# EAGLE design driver_04_2_2018 (EAGLE 6.6.0)
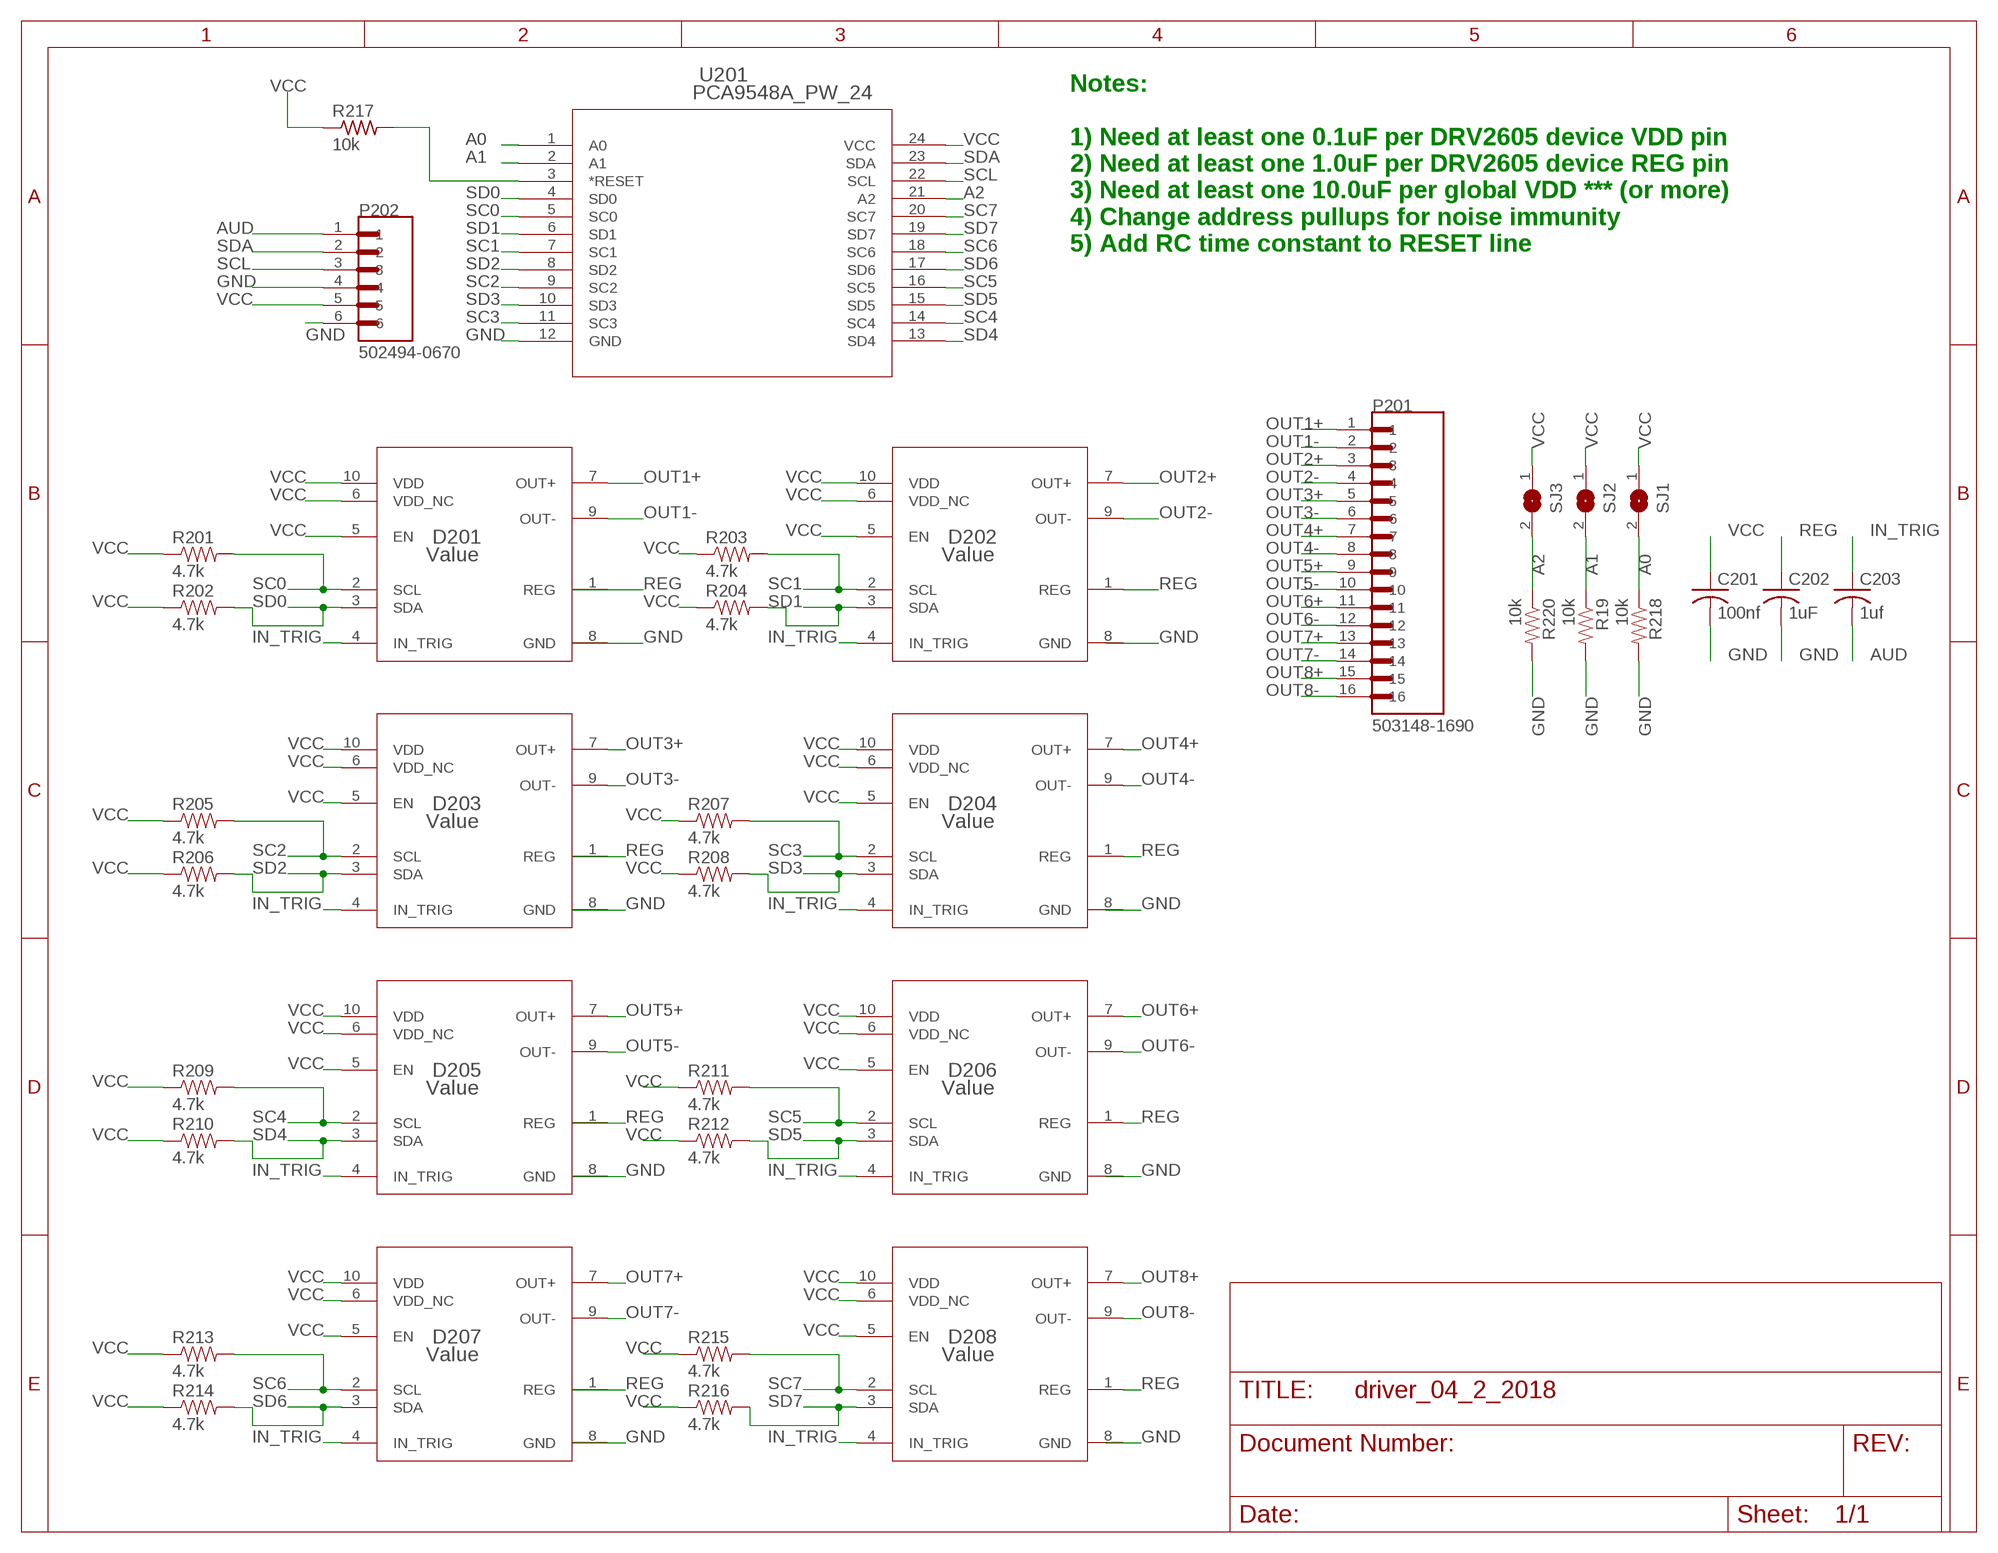
[diagram p0: schematic, sheet 1]

## Parts
C201  100nf  C-USC0603  [C0603]
C202  1uF  C-USC0603  [C0603]
C203  1uf  C-USC0603  [C0603]
D201  Value  DRV2605LDGSR  [DGS0010A]
D202  Value  DRV2605LDGSR  [DGS0010A]
D203  Value  DRV2605LDGSR  [DGS0010A]
D204  Value  DRV2605LDGSR  [DGS0010A]
D205  Value  DRV2605LDGSR  [DGS0010A]
D206  Value  DRV2605LDGSR  [DGS0010A]
D207  Value  DRV2605LDGSR  [DGS0010A]
D208  Value  DRV2605LDGSR  [DGS0010A]
P201  503148-1690  [MOLEX_503148-1690]
P202  502494-0670  [MOLEX_502494-0670]
R19  10k  RESISTOR0402-TYP  [EIA-0402]
R201  4.7k  RESISTOR0402-TYP  [EIA-0402]
R202  4.7k  RESISTOR0402-TYP  [EIA-0402]
R203  4.7k  RESISTOR0402-TYP  [EIA-0402]
R204  4.7k  RESISTOR0402-TYP  [EIA-0402]
R205  4.7k  RESISTOR0402-TYP  [EIA-0402]
R206  4.7k  RESISTOR0402-TYP  [EIA-0402]
R207  4.7k  RESISTOR0402-TYP  [EIA-0402]
R208  4.7k  RESISTOR0402-TYP  [EIA-0402]
R209  4.7k  RESISTOR0402-TYP  [EIA-0402]
R210  4.7k  RESISTOR0402-TYP  [EIA-0402]
R211  4.7k  RESISTOR0402-TYP  [EIA-0402]
R212  4.7k  RESISTOR0402-TYP  [EIA-0402]
R213  4.7k  RESISTOR0402-TYP  [EIA-0402]
R214  4.7k  RESISTOR0402-TYP  [EIA-0402]
R215  4.7k  RESISTOR0402-TYP  [EIA-0402]
R216  4.7k  RESISTOR0402-TYP  [EIA-0402]
R217  10k  R-US_R0402  [R0402]
R218  10k  RESISTOR0402-TYP  [EIA-0402]
R220  10k  RESISTOR0402-TYP  [EIA-0402]
SJ1  SJ  [SJ]
SJ2  SJ  [SJ]
SJ3  SJ  [SJ]
U201  PCA9548A_PW_24  [PW24]

## Nets
A0: R218.1 SJ1.2 U201.1(A0)
A1: R19.1 SJ2.2 U201.2(A1)
A2: R220.1 SJ3.2 U201.21(A2)
AUD: C203.2 P202.1
GND: C201.2 C202.2 D201.8(GND) D202.8(GND) D203.8(GND) D204.8(GND) D205.8(GND) D206.8(GND) D207.8(GND) D208.8(GND) P202.4 P202.6 R19.2 R218.2 R220.2 U201.12(GND)
IN_TRIG: C203.1 D201.4(IN_TRIG) D202.4(IN_TRIG) D203.4(IN_TRIG) D204.4(IN_TRIG) D205.4(IN_TRIG) D206.4(IN_TRIG) D207.4(IN_TRIG) D208.4(IN_TRIG)
OUT1+: D201.7(OUT+) P201.1
OUT1-: D201.9(OUT-) P201.2
OUT2+: D202.7(OUT+) P201.3
OUT2-: D202.9(OUT-) P201.4
OUT3+: D203.7(OUT+) P201.5
OUT3-: D203.9(OUT-) P201.6
OUT4+: D204.7(OUT+) P201.7
OUT4-: D204.9(OUT-) P201.8
OUT5+: D205.7(OUT+) P201.9
OUT5-: D205.9(OUT-) P201.10
OUT6+: D206.7(OUT+) P201.11
OUT6-: D206.9(OUT-) P201.12
OUT7+: D207.7(OUT+) P201.13
OUT7-: D207.9(OUT-) P201.14
OUT8+: D208.7(OUT+) P201.15
OUT8-: D208.9(OUT-) P201.16
REG: C202.1 D201.1(REG) D202.1(REG) D203.1(REG) D204.1(REG) D205.1(REG) D206.1(REG) D207.1(REG) D208.1(REG)
RESET: R217.2 U201.3(*RESET)
SC0: D201.2(SCL) R201.2 U201.5(SC0)
SC1: D202.2(SCL) R203.2 U201.7(SC1)
SC2: D203.2(SCL) R205.2 U201.9(SC2)
SC3: D204.2(SCL) R207.2 U201.11(SC3)
SC4: D205.2(SCL) R209.2 U201.14(SC4)
SC5: D206.2(SCL) R211.2 U201.16(SC5)
SC6: D207.2(SCL) R213.2 U201.18(SC6)
SC7: D208.2(SCL) R215.2 U201.20(SC7)
SCL: P202.3 U201.22(SCL)
SD0: D201.3(SDA) R202.2 U201.4(SD0)
SD1: D202.3(SDA) R204.2 U201.6(SD1)
SD2: D203.3(SDA) R206.2 U201.8(SD2)
SD3: D204.3(SDA) R208.2 U201.10(SD3)
SD4: D205.3(SDA) R210.2 U201.13(SD4)
SD5: D206.3(SDA) R212.2 U201.15(SD5)
SD6: D207.3(SDA) R214.2 U201.17(SD6)
SD7: D208.3(SDA) R216.2 U201.19(SD7)
SDA: P202.2 U201.23(SDA)
VCC: C201.1 D201.5(EN) D201.6(VDD_NC) D201.10(VDD) D202.5(EN) D202.6(VDD_NC) D202.10(VDD) D203.5(EN) D203.6(VDD_NC) D203.10(VDD) D204.5(EN) D204.6(VDD_NC) D204.10(VDD) D205.5(EN) D205.6(VDD_NC) D205.10(VDD) D206.5(EN) D206.6(VDD_NC) D206.10(VDD) D207.5(EN) D207.6(VDD_NC) D207.10(VDD) D208.5(EN) D208.6(VDD_NC) D208.10(VDD) P202.5 R201.1 R202.1 R203.1 R204.1 R205.1 R206.1 R207.1 R208.1 R209.1 R210.1 R211.1 R212.1 R213.1 R214.1 R215.1 R216.1 R217.1 SJ1.1 SJ2.1 SJ3.1 U201.24(VCC)

## Notes on the sheet
- Notes:
  
  1) Need at least one 0.1uF per DRV2605 device VDD pin
  2) Need at least one 1.0uF per DRV2605 device REG pin
  3) Need at least one 10.0uF per global VDD *** (or more)
  4) Change address pullups for noise immunity
  5) Add RC time constant to RESET line

## Library data of the parts
C201-C203 = rcl:C-US: CAPACITOR, American symbol
D201-D208 = DRV2605L_DGSR:DRV2605LDGSR; COMPTYPE: IC; MANUFACTURER: Texas Instruments; MOUNTTYPE: SMT; PACKAGEREFERENCE: DGS0010A; PARTNUMBER: DRV2605LDGS; PIN_COUNT: 10; REFDES: RefDes; ROHS: Y; TYPE: TYPE
P201 = 503148-1690:503148-1690: 1.50mm Pitch CLIK-Mate™ Wire-to-Board PCB Receptacle, Dual Row, Right Angle, 16 Circuits; AVAILABILITY: Good; DESCRIPTION: 1.50mm Pitch CLIK-Mate™ Wire-to-Board PCB Receptacle, Dual Row, Right Angle, 16 Circuits; MF: Molex; MP: 503148-1690; PACKAGE: None; PRICE: 1.51 USD
P202 = 502494-0670:502494-0670: 2.00mm Pitch CLIK-Mate™ Wire-to-Board PCB Receptacle, Single Row, Right Angle, 6 Circuits; AVAILABILITY: Good; DESCRIPTION: 2.00mm Pitch CLIK-Mate™ Wire-to-Board PCB Receptacle, Single Row, Right Angle, 6 Circuits; MF: Molex; MP: 502494-0670; PACKAGE: None; PRICE: 0.53 USD
R19 R201-R216 R218 R220 = PatternAgents-ProtoPads:RESISTOR: Resistor Basic schematic elements and footprints for 0603, 1206, and PTH resistors.
R217 = resistor:R-US_: RESISTOR, American symbol
SJ1-SJ3 = jumper:SJ: SMD solder JUMPER
U201 = PCA9548A_PW_124:PCA9548A_PW_24; DATASHEETURL: http://www.ti.com/lit/gpn/PCA9548A; DESCRIPTION: 8-Channel I2C Switch With Reset; FAMILY_NAME: I2C MULTIPLEXER, SWITCH; GENERIC_PART_NUMBER: PCA9548A; INDUSTRY_STD_PKG_TYPE: TSSOP; MANUFACTURER: Texas Instruments; MANUFACTURER_PART_NUMBER: pca9548a_pw_24; PACKAGE_DESIGNATOR: PW; PIN_COUNT: 24; VENDOR: Texas Instruments

## Net classes
0 default: width 0.1 mm, drill 0.185 mm, clearance 0.1 mm

## Board
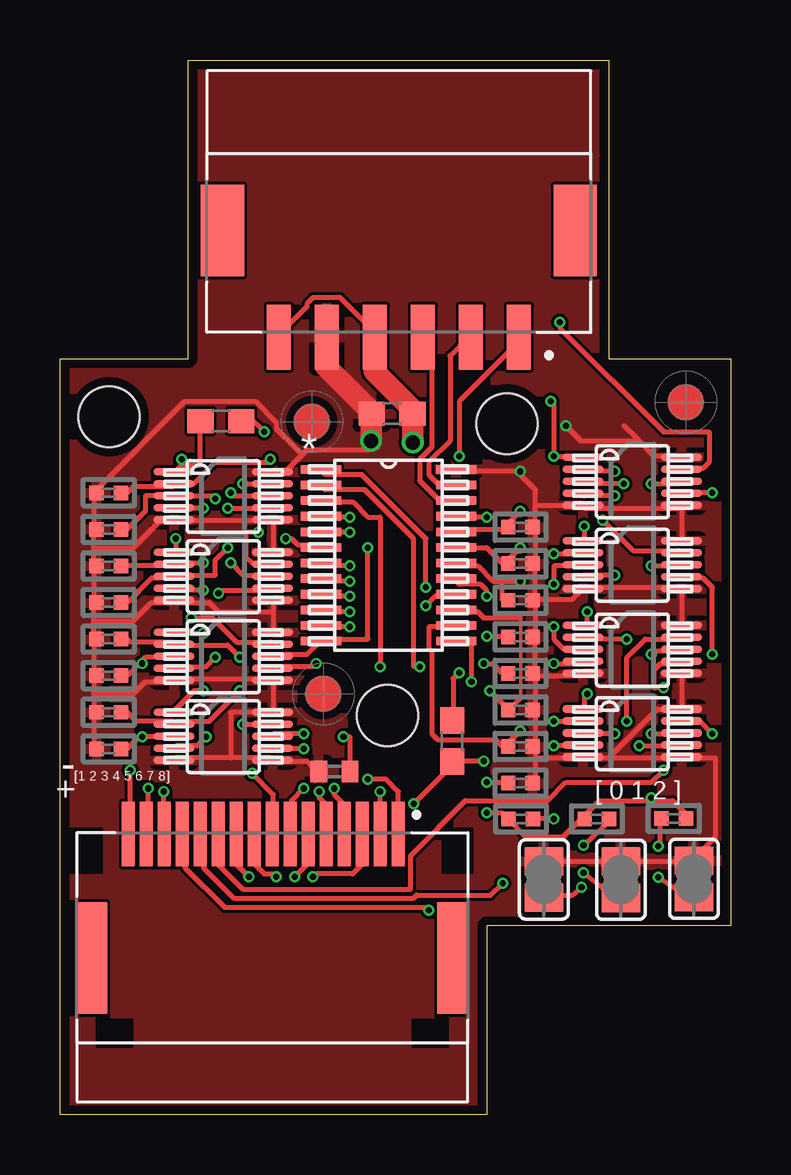
[diagram p1: board, top side]
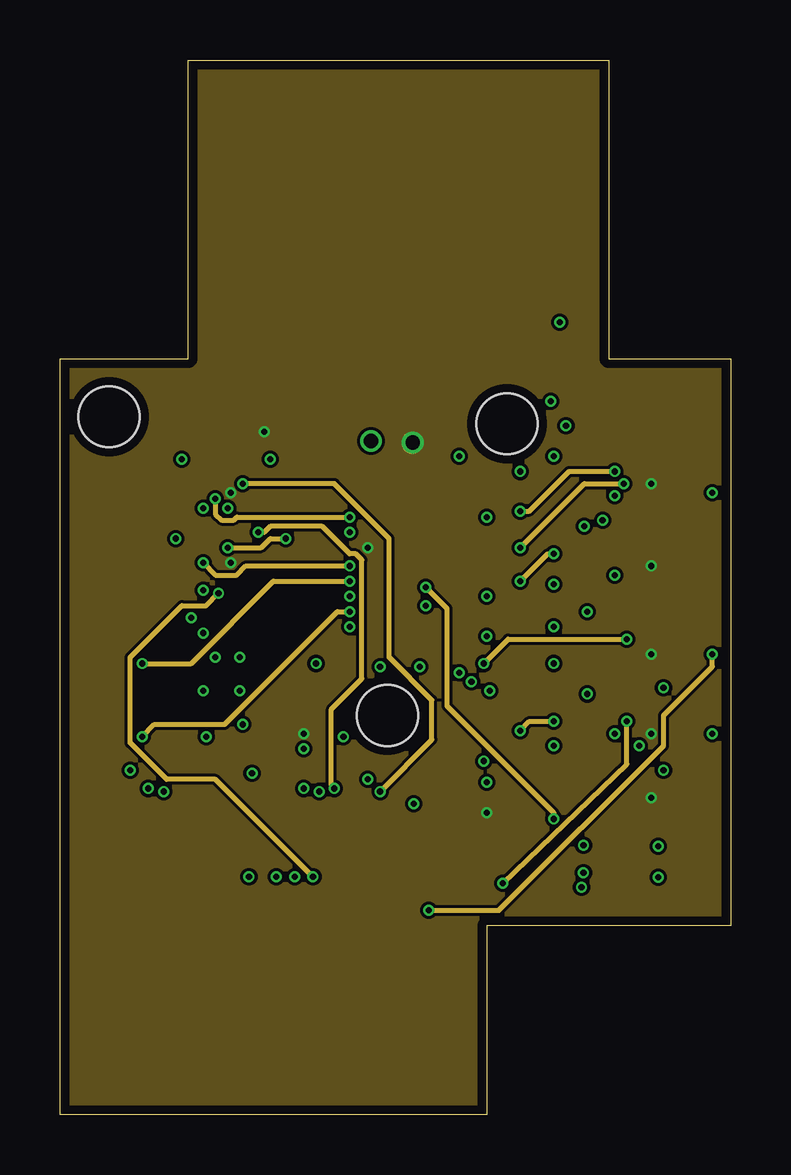
[diagram p2: board, inner layer Route2]
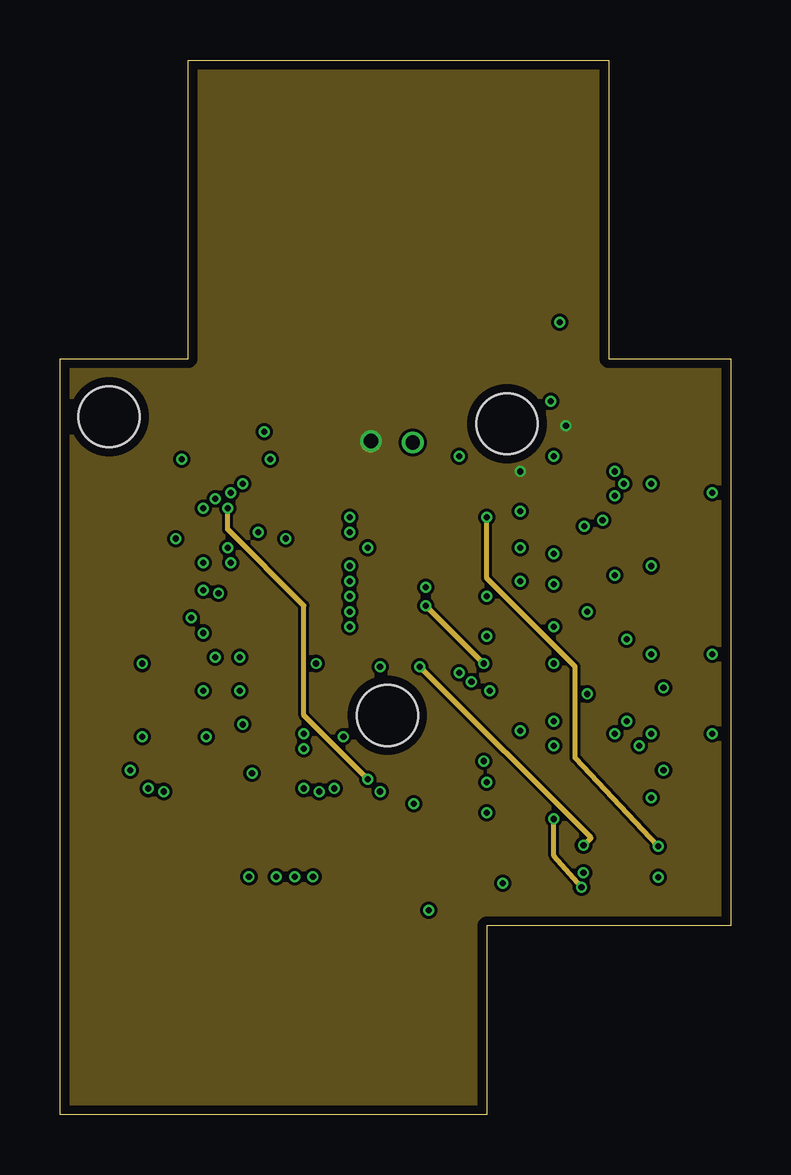
[diagram p3: board, inner layer Route15]
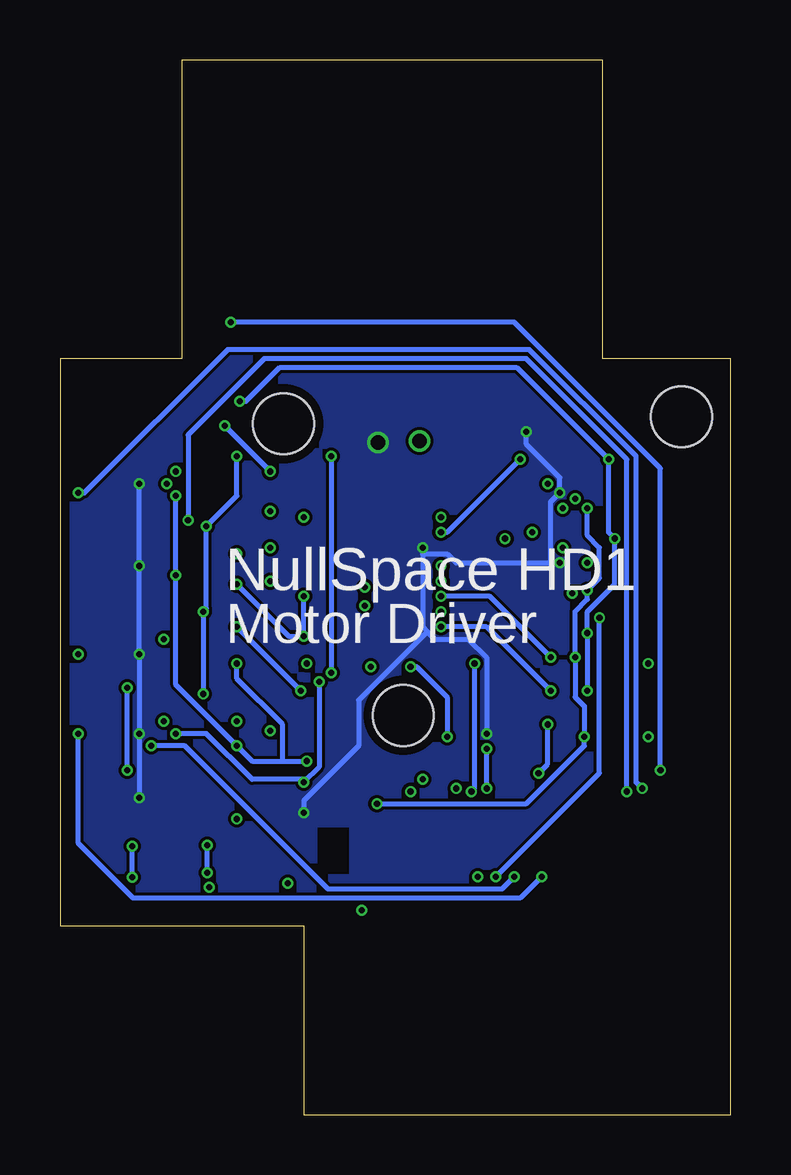
[diagram p4: board, bottom side, seen from below]

Size 27.94 x 43.94 mm. Coordinates in mm from the lower left corner, seen from the top.
Outline: 5.33,31.5 5.33,43.94 22.86,43.94 22.86,31.5 27.94,31.5 27.94,7.87 17.78,7.87 17.78,0 0,0 0,31.5 5.33,31.5
Copper layers (1*2*15*16): Top 0.035559375mm / dielectric 0.17018125mm / Route2 0.01778125mm / dielectric 47mil / Route15 0.01778125mm / dielectric 0.17018125mm / Bottom 0.035559375mm
Design rules "OSHPark-4layer": minimum track width 5mil, minimum drill 10mil, track to track 5mil, track to pad 5mil, pad to pad 5mil, via to via 5mil, smd to smd 5mil, copper to edge 15mil, drill to drill 6mil, minimum pad ring 4mil, minimum via ring 4mil, stop-mask expansion 2.5mil, vias tented up to drill 0mil, thermal gap 10mil
Holes 2.54 mm at 2.05,29.08 18.63,28.79 13.64,16.64

### Footprints (pad centres in the part's own frame; a part is rotated, then mirrored left to right if it is on the bottom)
C0603 = smd 1.1 x 1: 1 -0.85,0; 2 0.85,0
DGS0010A = smd 1.702 x 0.305: 1 -2.05,1; 2 -2.05,0.5; 3 -2.05,0; 4 -2.05,-0.5; 5 -2.05,-1; 6 2.05,-1; 7 2.05,-0.5; 8 2.05,0; 9 2.05,0.5; 10 2.05,1
MOLEX_503148-1690 = smd 0.55 x 2.7: 1 5.25,0; 2 4.5,0; 3 3.75,0; 4 3,0; 5 2.25,0; 6 1.5,0; 7 0.75,0; 8 0,0; 9 -0.75,0; 10 -1.5,0; 11 -2.25,0; 12 -3,0; 13 -3.75,0; 14 -4.5,0; 15 -5.25,0; 16 -6,0 | smd 1.2 x 4.65: P1 7.48,-5.175; P2 -7.48,-5.175
MOLEX_502494-0670 = smd 1 x 2.7: 1 -5,0; 2 -3,0; 3 -1,0; 4 1,0; 5 3,0; 6 5,0 | smd 1.8 x 3.8: P1 -7.35,-4.45; P2 7.35,-4.45
EIA-0402 = smd 0.6 x 0.6: 1 -0.508,0; 2 0.508,0
R0402 = smd 0.7 x 0.9: 1 -0.65,0; 2 0.65,0
SJ = smd 1.168 x 1.6: 1 -0.762,0; 2 0.762,0
PW24 = smd 1.676 x 0.356: 1 -2.819,3.575; 2 -2.819,2.925; 3 -2.819,2.275; 4 -2.819,1.625; 5 -2.819,0.975; 6 -2.819,0.325; 7 -2.819,-0.325; 8 -2.819,-0.975; 9 -2.819,-1.625; 10 -2.819,-2.275; 11 -2.819,-2.925; 12 -2.819,-3.575; 13 2.819,-3.575; 14 2.819,-2.925; 15 2.819,-2.275; 16 2.819,-1.625; 17 2.819,-0.975; 18 2.819,-0.325; 19 2.819,0.325; 20 2.819,0.975; 21 2.819,1.625; 22 2.819,2.275; 23 2.819,2.925; 24 2.819,3.575

### Placement (x,y rotation side)
C201  13.84,29.2 0 top
C202  6.7,28.9 0 top
C203  16.35,15.57 90 top
D201  6.8,25.78 0 top
D202  6.81,22.44 0 top
D203  6.8,19.1 0 top
D204  6.8,15.77 0 top
D205  23.85,15.9 0 top
D206  23.85,19.38 0 top
D207  23.85,22.91 0 top
D208  23.85,26.39 0 top
P201  8.85,11.7 0 top
P202  14.12,32.39 180 top
R19  22.37,12.32 180 top
R201  2.03,25.91 0 top
R202  2.03,24.38 0 top
R203  2.03,22.86 0 top
R204  2.03,21.34 0 top
R205  2.03,19.81 0 top
R206  2.03,18.29 0 top
R207  2.03,16.76 0 top
R208  2.03,15.24 0 top
R209  19.19,15.34 180 top
R210  19.19,13.81 180 top
R211  19.19,18.38 180 top
R212  19.19,16.86 180 top
R213  19.19,21.43 180 top
R214  19.19,19.91 180 top
R215  19.19,24.48 180 top
R216  19.19,22.96 180 top
R217  11.43,14.3 0 top
R218  19.2,12.32 180 top
R220  25.57,12.34 0 top
SJ1  20.16,9.8 270 top
SJ2  23.37,9.79 270 top
SJ3  26.41,9.82 270 top
U201  13.69,23.31 0 top
U$1  [FIDUCIAL_G15]  10.97,17.53 0 top
U$2  [FIDUCIAL_G15]  10.5,28.87 0 top
U$4  [FIDUCIAL_G15]  26.08,29.69 0 top

### Tracks (layer width: path | path; a pad name or v marks a point on that pad's centre or on a via)
A0  (via drill 0.25)
  Top 0.203: v20.57,12.32 19.94,12.32 R218.1 | v21.73,9.47 21.34,9.14 20.19,9.14 SJ1.2 | v15.24,21.97 15.24,24 12.57,26.67 11.05,26.67 10.92,26.8 U201.1
  Route2 0.203: v15.24,21.97 16.13,21.08 16.13,17.02 20.57,12.57 v20.57,12.32
  Route15 0.203: v20.57,12.32 20.57,10.8 v21.73,9.47
A1  (via drill 0.25)
  Top 0.203: v21.81,11.23 22.99,12.32 R19.1 | v21.81,10.08 22.99,9.14 23.37,9.14 SJ2.2 | v14.99,18.67 14.73,18.67 14.73,24 12.7,26.03 11.05,26.03 10.92,26.16 U201.2
  Route15 0.203: v14.99,18.67 22.13,11.53 v21.81,11.23
  Bottom 0.203: v21.81,10.08 v21.81,11.23
A2  (via drill 0.25)
  Top 0.203: v24.93,11.18 25.02,11.18 25.02,12.32 R220.1 | v24.92,9.9 26.04,9.14 26.29,9.14 SJ3.2 | v17.78,24.89 16.51,24.89 U201.21
  Route15 0.203: v17.78,24.89 17.78,22.35 21.46,18.67 21.46,14.86 v24.93,11.18
  Bottom 0.203: v24.92,9.9 v24.93,11.18
AUD  (via drill 0.25)
  Top 0.203: v16.64,18.42 16.38,18.16 16.38,16.51 C203.2 | v16.64,27.43 16.64,29.72 19.05,32.13 19.05,32.39 P202.1
  Bottom 0.203: v16.64,27.43 v16.64,18.42
GND  (via drill 0.25, 0.6)
  Top 0.203: 24.64,13.08 22.48,13.08 21.84,12.45 R19.2 21.72,12.32 20.96,11.56 19.43,11.56 18.67,12.32 R218.2 18.54,12.45 18.42,12.57 v17.78,12.57 | 24.64,13.08 25.53,13.08 26.16,12.45 R220.2 | v24.64,15.88 25.78,15.88 D205.8 | v24.64,19.18 24.77,19.3 25.78,19.3 D206.8 | v24.64,22.86 25.78,22.86 D207.8 | v24.64,26.29 25.78,26.29 D208.8 | v24.64,13.21 24.64,13.08 | 7.62,28.96 C202.2 7.87,29.08 v8.51,28.45 | D203.8 8.89,19.18 10.29,19.18 10.79,19.69 U201.12 10.92,19.81 12.83,19.81 v12.83,23.62 | v10.16,15.88 8.89,15.88 D204.8 | v7.11,22.99 7.62,22.48 8.76,22.48 D202.8 | D201.8 7.24,25.78 v7.11,25.91 | P202.6 9.14,32.51 10.29,33.66 10.29,33.78 10.54,34.04 11.68,34.04 12.95,32.77 P202.4
  Top 0.889: 13.09,30.98 P202.4 13.13,32.38 13.1,30.97 14.69,29.38 C201.2 14.7,29.19 v14.7,28
  Route2 0.889: v14.7,28 14.68,27.98 14.68,28.01
  Bottom 0.203: v24.64,26.29 v24.64,22.86 v24.64,19.18 v24.64,15.88 v24.64,13.21 | v10.16,15.88 10.16,19.05 10.92,19.81 12.32,19.81 12.64,20.13 | 12.64,20.13 12.83,20.32 12.83,23.37 | v12.83,23.62 12.83,23.37 | 7.49,22.99 11.43,22.99 11.81,23.37 12.83,23.37 | 7.49,22.99 v7.11,22.99 | 7.49,22.99 7.49,25.53 v7.11,25.91 7.11,26.54 8.51,27.94 v8.51,28.45 | v17.78,12.57 17.78,13.08 15.49,15.37 15.49,17.27 12.64,20.13
  pour Route2: -6.1,49.02 34.54,49.02 34.54,-4.32 -6.1,-4.32
  pour Bottom: -6.1,46.48 29.46,46.48 29.46,-1.78 -6.1,-1.78
IN_TRIG  (via drill 0.25)
  Top 0.203: v6.1,15.75 5.71,15.37 4.83,15.37 D204.4 | v6.48,19.05 6.1,18.67 4.83,18.67 D203.4 | v5.97,21.84 4.83,21.84 D202.4 | v5.97,25.27 4.83,25.27 D201.4 | v17.65,14.73 16.38,14.73 C203.1 16.38,14.61 v14.73,12.95 | v20.57,15.37 21.72,15.37 D205.4 | v20.57,18.8 21.72,18.8 D206.4 | v23.11,22.48 21.84,22.48 D207.4 | v23.11,25.78 21.84,25.78 D208.4
  Bottom 0.203: v5.97,25.27 5.97,24.13 5.46,23.62 5.46,22.35 v5.97,21.84 5.97,21.46 6.48,20.95 v6.48,19.05 6.48,17.4 6.1,17.02 v6.1,15.75 6.1,15.37 8.51,12.95 v14.73,12.95 | 18.67,14.73 19.94,14.73 v20.57,15.37 23.11,17.91 v23.11,22.48 v23.11,25.78 | 18.67,14.73 v17.65,14.73 | v20.57,18.8 20.57,18.16 18.67,16.26 18.67,14.73
OUT1+  (via drill 0.25)
  Top 0.203: v6.99,25.27 8.76,25.27 D201.7 | v12.83,13.97 13.59,13.97 14.1,13.46 14.1,11.81 P201.1
  Route15 0.203: v6.99,25.27 6.99,24.38 10.16,21.21 10.16,16.64 v12.83,13.97
OUT1-  (via drill 0.25)
  Top 0.203: v7.62,26.29 8.76,26.29 D201.9 | v13.34,13.46 13.34,11.81 P201.2
  Route2 0.203: v7.62,26.29 11.43,26.29 13.72,24 13.72,19.05 15.49,17.27 15.49,15.62 v13.34,13.46
OUT2+  (via drill 0.25)
  Top 0.203: v6.6,21.72 6.73,21.84 8.76,21.84 D202.7 | v10.54,9.91 10.67,10.03 12.19,10.03 12.57,10.41 12.57,11.68 P201.3
  Route2 0.203: v6.6,21.72 6.1,21.21 5.08,21.21 2.92,19.05 2.92,15.49 4.45,13.97 6.48,13.97 v10.54,9.91
OUT2-  (via drill 0.25)
  Top 0.203: v8.25,24.26 7.75,24.26 7.75,23.24 8,22.99 8.76,22.99 D202.9 | v11.43,13.59 11.43,13.33 11.81,12.95 11.81,11.81 P201.4
  Route2 0.203: v8.25,24.26 8.51,24.26 8.76,24.51 10.92,24.51 12.07,23.37 12.32,23.37 12.57,23.11 12.57,18.16 11.3,16.89 11.3,13.72 v11.43,13.59
OUT3+  (via drill 0.25)
  Top 0.203: v10.67,18.8 10.54,18.67 8.89,18.67 D203.7 | v10.79,13.46 10.79,13.21 11.05,12.95 11.05,11.81 P201.5
  Bottom 0.203: v10.67,18.8 10.67,13.59 v10.79,13.46
OUT3-  (via drill 0.25)
  Top 0.203: v5.46,20.7 6.35,20.7 7.37,19.69 8.76,19.69 D203.9 | v9.78,9.91 10.29,10.41 10.29,11.68 P201.6
  Bottom 0.203: v5.46,20.7 5.46,14.22 v9.78,9.91
OUT4+  (via drill 0.25)
  Top 0.203: v10.16,15.24 8.89,15.24 D204.7 | v10.16,13.59 9.65,13.08 9.65,11.81 P201.7
  Bottom 0.203: v10.16,13.59 v10.16,15.24
OUT4-  (via drill 0.25)
  Top 0.203: v7.62,16.26 8.76,16.26 D204.9 | v8,14.22 8.89,13.33 8.89,11.81 P201.8
  Bottom 0.203: v7.62,16.26 7.62,14.61 v8,14.22
OUT5+  (via drill 0.25)
  Top 0.203: v24.13,15.37 25.78,15.37 D205.7 | v9.02,9.91 8.89,10.03 8.51,10.03 8.13,10.41 8.13,11.68 P201.9
  Bottom 0.203: v24.13,15.37 22.73,15.37 16.76,9.4 9.53,9.4 v9.02,9.91
OUT5-  (via drill 0.25)
  Top 0.203: v27.18,15.88 26.67,16.38 25.91,16.38 D205.9 | v7.87,9.91 7.37,10.41 7.37,11.68 P201.10
  Bottom 0.203: v27.18,15.88 27.18,11.3 24.89,9.02 8.76,9.02 v7.87,9.91
OUT6+  (via drill 0.25)
  Top 0.203: v25.15,17.78 24.77,17.78 24.77,18.54 25.02,18.8 25.78,18.8 D206.7 | v25.15,14.35 24.64,13.84 21.08,13.84 20.32,13.08 16.89,13.08 14.61,10.8 14.61,9.4 7.62,9.4 6.6,10.41 P201.11
  Bottom 0.203: v25.15,14.35 v25.15,17.78
OUT6-  (via drill 0.25)
  Top 0.203: v23.62,16.38 23.62,19.05 24.38,19.81 25.78,19.81 D206.9 | v18.45,9.64 17.93,9.14 14.86,9.14 14.73,9.02 7.24,9.02 5.97,10.29 5.97,11.68 P201.12
  Route2 0.203: v23.62,16.38 23.62,14.61 v18.45,9.64
OUT7+  (via drill 0.25)
  Top 0.203: v27.18,19.18 27.18,21.97 26.8,22.35 25.91,22.35 D207.7 | v15.37,8.51 15.24,8.64 6.86,8.64 5.21,10.29 5.21,11.68 P201.13
  Route2 0.203: v27.18,19.18 27.18,18.67 25.15,16.64 25.15,15.37 18.29,8.51 v15.37,8.51
OUT7-  (via drill 0.25)
  Top 0.203: v22.61,24.77 23.88,23.5 25.78,23.5 D207.9 | v4.32,13.46 4.32,11.81 P201.14
  Bottom 0.203: v22.61,24.77 22.61,28.32 19.43,31.5 8.51,31.5 4.32,27.31 v4.32,13.46
OUT8+  (via drill 0.25)
  Top 0.203: v27.18,25.91 25.91,25.91 D208.7 | v3.68,13.59 3.68,11.81 P201.15
  Bottom 0.203: v27.18,25.91 26.92,25.91 20.96,31.88 8.38,31.88 3.94,27.43 3.94,13.84 v3.68,13.59
OUT8-  (via drill 0.25)
  Top 0.203: v20.83,33.02 20.83,32.77 25.15,28.45 27.05,28.45 27.05,27.18 26.8,26.92 25.91,26.92 D208.9 | v2.92,14.35 2.92,11.81 P201.16
  Bottom 0.203: v20.83,33.02 9.02,33.02 2.92,26.92 v2.92,14.35
REG  (via drill 0.25)
  Top 0.203: v21.97,17.53 21.84,17.53 21.84,17.02 D205.1 | v21.97,20.95 21.97,20.45 21.84,20.45 D206.1 | v21.84,24.51 21.84,24 D207.1 | D208.1 21.72,27.43 v20.57,27.43 20.57,29.72 v20.45,29.72 | 5.08,27.05 5.84,27.05 5.84,28.83 C202.1 | 5.08,27.05 4.83,26.8 D201.1 | v5.97,17.65 5.59,17.65 4.83,16.89 D204.1 | v5.97,20.07 4.83,20.07 D203.1 | v4.83,24 4.83,23.5 D202.1 | v5.08,27.31 5.08,27.05
  Bottom 0.203: v21.97,17.53 v21.97,20.95 21.84,21.08 v21.84,24.51 20.57,25.78 v20.57,27.43 | v5.97,17.65 v5.97,20.07 5.97,20.95 4.83,22.1 v4.83,24 5.08,24.26 v5.08,27.31 8.89,31.11 18.8,31.11 20.19,29.72 v20.45,29.72
RESET  (via drill 0.25)
  Top 0.203: v11.81,15.75 12.07,15.75 12.07,14.35 R217.2 | v13.34,18.67 13.34,24.89 12.83,24.89 12.19,25.53 10.92,25.53 U201.3
  Bottom 0.203: v11.81,15.75 11.81,17.4 13.08,18.67 v13.34,18.67
SC0  (via drill 0.25)
  Top 0.203: R201.2 2.79,25.91 3.05,26.16 4.7,26.16 D201.2 4.83,26.29 5.59,26.29 6.48,27.18 8.64,27.18 v8.76,27.31 | v12.07,24.26 10.92,24.26 U201.5
  Bottom 0.203: v12.07,24.26 11.81,24.26 v8.76,27.31
SC1  (via drill 0.25)
  Top 0.203: R203.2 4.7,22.86 D202.2 4.83,22.99 v5.97,22.99 | v12.07,22.86 10.92,22.86 U201.7
  Route2 0.203: v12.07,22.86 7.75,22.86 7.37,22.48 6.48,22.48 v5.97,22.99
SC2  (via drill 0.25)
  Top 0.203: R205.2 2.79,19.81 2.92,19.69 4.7,19.69 D203.2 4.83,19.56 6.99,19.56 v7.49,19.05 | v12.07,21.59 10.92,21.59 U201.9
  Bottom 0.203: v12.07,21.59 10.03,21.59 v7.49,19.05
SC3  (via drill 0.25)
  Top 0.203: R207.2 2.79,16.76 3.18,16.38 4.7,16.38 D204.2 4.83,16.38 6.22,16.38 v7.49,17.65 | v12.07,20.32 10.92,20.32 U201.11
  Bottom 0.203: v12.07,20.32 10.16,20.32 v7.49,17.65
SC4  (via drill 0.25)
  Top 0.203: U201.14 16.51,20.32 15.37,20.32 15.37,19.43 15.49,19.3 15.49,15.88 15.75,15.62 18.16,15.62 18.42,15.37 R209.2 18.54,15.37 v19.18,16 | v20.57,16.38 21.72,16.38 D205.2
  Route2 0.203: v20.57,16.38 19.56,16.38 v19.18,16
SC5  (via drill 0.25)
  Top 0.203: v17.65,18.8 18.03,18.8 18.42,18.42 R211.2 | v15.24,21.21 15.62,21.59 16.51,21.59 U201.16 | v23.62,19.81 21.84,19.81 D206.2
  Route2 0.203: v23.62,19.81 18.67,19.81 v17.65,18.8
  Route15 0.203: v15.24,21.21 v17.65,18.8
SC6  (via drill 0.25)
  Top 0.203: 18.42,22.22 18.42,21.46 R213.2 | 18.42,22.22 18.03,22.22 17.4,22.86 16.51,22.86 U201.18 | v20.57,23.37 21.72,23.37 D207.2 | 18.42,22.22 v19.18,22.22
  Route2 0.203: v20.57,23.37 20.32,23.37 v19.18,22.22
SC7  (via drill 0.25)
  Top 0.203: U201.20 16.51,24.38 18.42,24.38 R215.2 18.54,24.51 v19.18,25.15 | v23.11,26.8 21.84,26.8 D208.2
  Route2 0.203: v23.11,26.8 21.21,26.8 19.56,25.15 v19.18,25.15
SCL
  Top 0.203: U201.22 16.51,25.65 15.75,25.65 14.99,26.42 14.99,27.31 15.49,27.81 15.49,32.89 15.43,32.96
  Top 0.254: 15.49,32.89 15.12,32.89 P202.3
SD0  (via drill 0.25)
  Top 0.203: R202.2 2.79,24.38 3.56,25.15 3.56,25.78 D201.3 6.35,25.78 v6.48,25.65 | v12.07,24.89 10.92,24.89 U201.4
  Route2 0.203: v12.07,24.89 7.37,24.89 7.24,24.77 6.73,24.77 6.48,25.02 v6.48,25.65
SD1  (via drill 0.25)
  Top 0.203: R204.2 2.79,21.34 3.81,22.35 4.7,22.35 D202.3 4.83,22.48 6.48,22.48 6.48,23.11 v6.99,23.62 | v9.4,24 9.65,24 9.91,23.75 10.79,23.75 U201.6
  Route2 0.203: v9.4,24 8.76,24 8.38,23.62 v6.99,23.62
SD2  (via drill 0.25)
  Top 0.203: 3.36,18.86 3.56,19.05 4.7,19.05 D203.3 | 3.36,18.86 2.79,18.29 R206.2 | v12.07,22.22 10.92,22.22 U201.8 | v3.43,18.8 3.36,18.86
  Route2 0.203: v12.07,22.22 8.89,22.22 5.46,18.8 v3.43,18.8
SD3  (via drill 0.25)
  Top 0.203: R208.2 2.79,15.24 3.3,15.75 v3.43,15.75 4.7,15.75 D204.3 | v12.07,20.95 10.92,20.95 U201.10
  Route2 0.203: v12.07,20.95 11.56,20.95 6.86,16.26 3.94,16.26 v3.43,15.75
SD4  (via drill 0.25)
  Top 0.203: v17.78,13.84 18.42,13.84 R210.2 | v17.14,18.03 17.14,19.69 16.51,19.69 U201.13 | v23.11,15.88 21.84,15.88 D205.3
  Bottom 0.203: v17.14,18.03 17.14,14.48 v17.78,13.84 17.78,13.97 19.94,13.97 21.84,15.88 v23.11,15.88
SD5  (via drill 0.25)
  Top 0.152: 19.19,20.7 19.19,17.36
  Top 0.178: 19.19,17.36 R212.2
  Top 0.203: 19.19,20.7 17.65,20.7 17.4,20.95 16.51,20.95 U201.15 | 18.54,16.89 R212.2 18.54,17.02 v17.91,17.65 | v20.57,20.32 20.57,19.81 20.96,19.43 21.72,19.43 D206.3
  Bottom 0.203: v17.91,17.65 v20.57,20.32
SD6  (via drill 0.25)
  Top 0.203: v17.78,19.94 18.42,19.94 R214.2 | v20.57,22.1 20.57,22.86 21.72,22.86 D207.3 | v17.78,21.59 17.78,21.84 17.53,22.1 16.64,22.1 16.51,22.22 U201.17
  Bottom 0.203: v20.57,22.1 18.42,19.94 v17.78,19.94 v17.78,21.59
SD7  (via drill 0.25)
  Top 0.203: U201.19 17.78,23.62 18.42,22.99 R216.2 18.54,22.99 v19.18,23.62 | v23.5,26.29 21.84,26.29 D208.3
  Route2 0.203: v23.5,26.29 21.84,26.29 v19.18,23.62
SDA
  Top 0.203: U201.23 16.51,26.29 15.75,26.29 15.37,26.67 15.37,27.18 16.26,28.07 16.26,31.62 17.02,32.39 P202.2
VCC  (via drill 0.25, 0.6)
  Top 0.203: D207.10 25.91,24 25.91,25.27 D208.6 25.78,25.27 21.84,25.27 D208.5 21.72,25.4 19.81,25.4 | 19.81,25.4 19.81,24.51 R215.1 19.81,24.38 19.81,22.99 R216.1 19.81,22.86 19.81,21.46 R213.1 | 19.81,25.4 19.81,25.91 | 19.81,26.03 19.11,26.73 | 19.11,26.73 19.05,26.8 16.51,26.8 U201.24 | SJ1.1 20.19,10.54 23.37,10.54 SJ2.1 23.5,10.54 26.29,10.54 SJ3.1 26.42,10.67 27.31,11.56 27.31,14.86 25.91,14.86 D205.6 25.78,14.86 22.86,14.86 | D206.10 25.91,20.45 25.91,21.84 D207.6 25.78,21.97 21.84,21.97 D207.5 21.72,21.84 21.34,21.46 19.94,21.46 R213.1 | D206.6 25.91,18.29 25.91,17.02 D205.10 25.78,16.89 24.89,16.89 22.86,14.86 | R213.1 19.81,21.34 19.81,19.94 R214.1 19.81,19.81 19.81,18.42 R211.1 | 19.81,14.86 19.81,15.24 R209.1 19.81,15.37 19.81,16.76 R212.1 19.81,16.89 19.81,18.29 R211.1 | 19.81,14.86 19.81,13.84 R210.1 | 19.81,14.86 21.72,14.86 D205.5 21.84,14.86 22.86,14.86 | D206.5 21.72,18.29 19.94,18.29 R211.1 | R217.1 10.67,14.35 10.29,14.73 8.89,14.73 D204.6 8.76,14.86 7.11,14.86 | 7.11,14.86 4.83,14.86 D204.5 | D202.10 8.89,23.5 8.89,24.77 D201.6 8.76,24.77 4.83,24.77 D201.5 4.7,24.77 4.19,24.77 3.05,23.62 1.4,23.62 | 8.89,20.95 8.89,21.34 D202.6 | 8.89,20.95 8.89,20.19 D203.10 | 7.11,14.86 7.11,16.76 8.76,16.76 D204.10 8.89,16.89 8.89,18.03 D203.6 8.76,18.16 4.83,18.16 D203.5 4.7,18.03 3.56,18.03 3.05,17.53 1.4,17.53 | 24.07,28.13 24.77,27.43 25.78,27.43 D208.10 | 24.07,28.13 23.5,28.7 | v21.08,28.7 21.72,28.07 24,28.07 24.07,28.13 | v19.18,26.8 19.11,26.73 | 10.1,27.5 10.29,27.69 12.83,27.69 v12.96,28.06 | 10.1,27.5 9.4,26.8 8.89,26.8 D201.10 | 1.4,25.91 1.4,24.38
  Top 0.203: 1.4,22.86 1.4,21.34 | 1.4,16.76 1.4,15.24 R208.1 | 1.4,19.81 1.4,18.29 | 1.4,18.29 1.4,17.53 | 1.4,17.53 1.4,16.76 | 1.4,16.76 R207.1 | 1.4,18.29 R206.1 | 1.4,19.81 1.4,20.57 | 1.4,20.57 1.4,21.34 | 1.4,21.34 R204.1 | 1.4,19.81 R205.1 | 1.4,22.86 1.4,23.62 | 1.4,23.62 1.4,24.38 | 1.4,24.38 R202.1 | 1.4,22.86 R203.1 | 1.4,20.57 3.05,20.57 3.81,21.34 4.7,21.34 D202.5 4.83,21.34 6.22,21.34 6.6,20.95 8.89,20.95 | 10.1,27.5 9.02,28.58 9.02,28.83 8.13,29.72 5.21,29.72 1.4,25.91 | 1.4,25.91 R201.1
  Top 0.889: P202.5 11.06,32.33 11.06,31.2 12.99,29.27 C201.1 12.96,29.17 v12.96,28.06
  Route15 0.889: v12.96,28.06 12.96,28.04
  Bottom 0.203: v21.08,28.7 v19.18,26.8
  pour Route15: -3.56,46.48 32,46.48 32,-1.78 -3.56,-1.78
  pour Top: -3.56,46.48 29.46,46.48 29.46,-1.78 -3.56,-1.78

### Text on the board
tNames: - | [1 2 3 4 5 6 7 8] | + | [ 0 1 2 ]
bNames: NullSpace HD1 | Motor Driver